# EasyEDA schematic Wildfire_Souce.json
TITLE: Sheet_1; REV: 1.0; Date: 2026-02-07; Sheet: 1/1; Drawn By: Razee; Company: Your Company
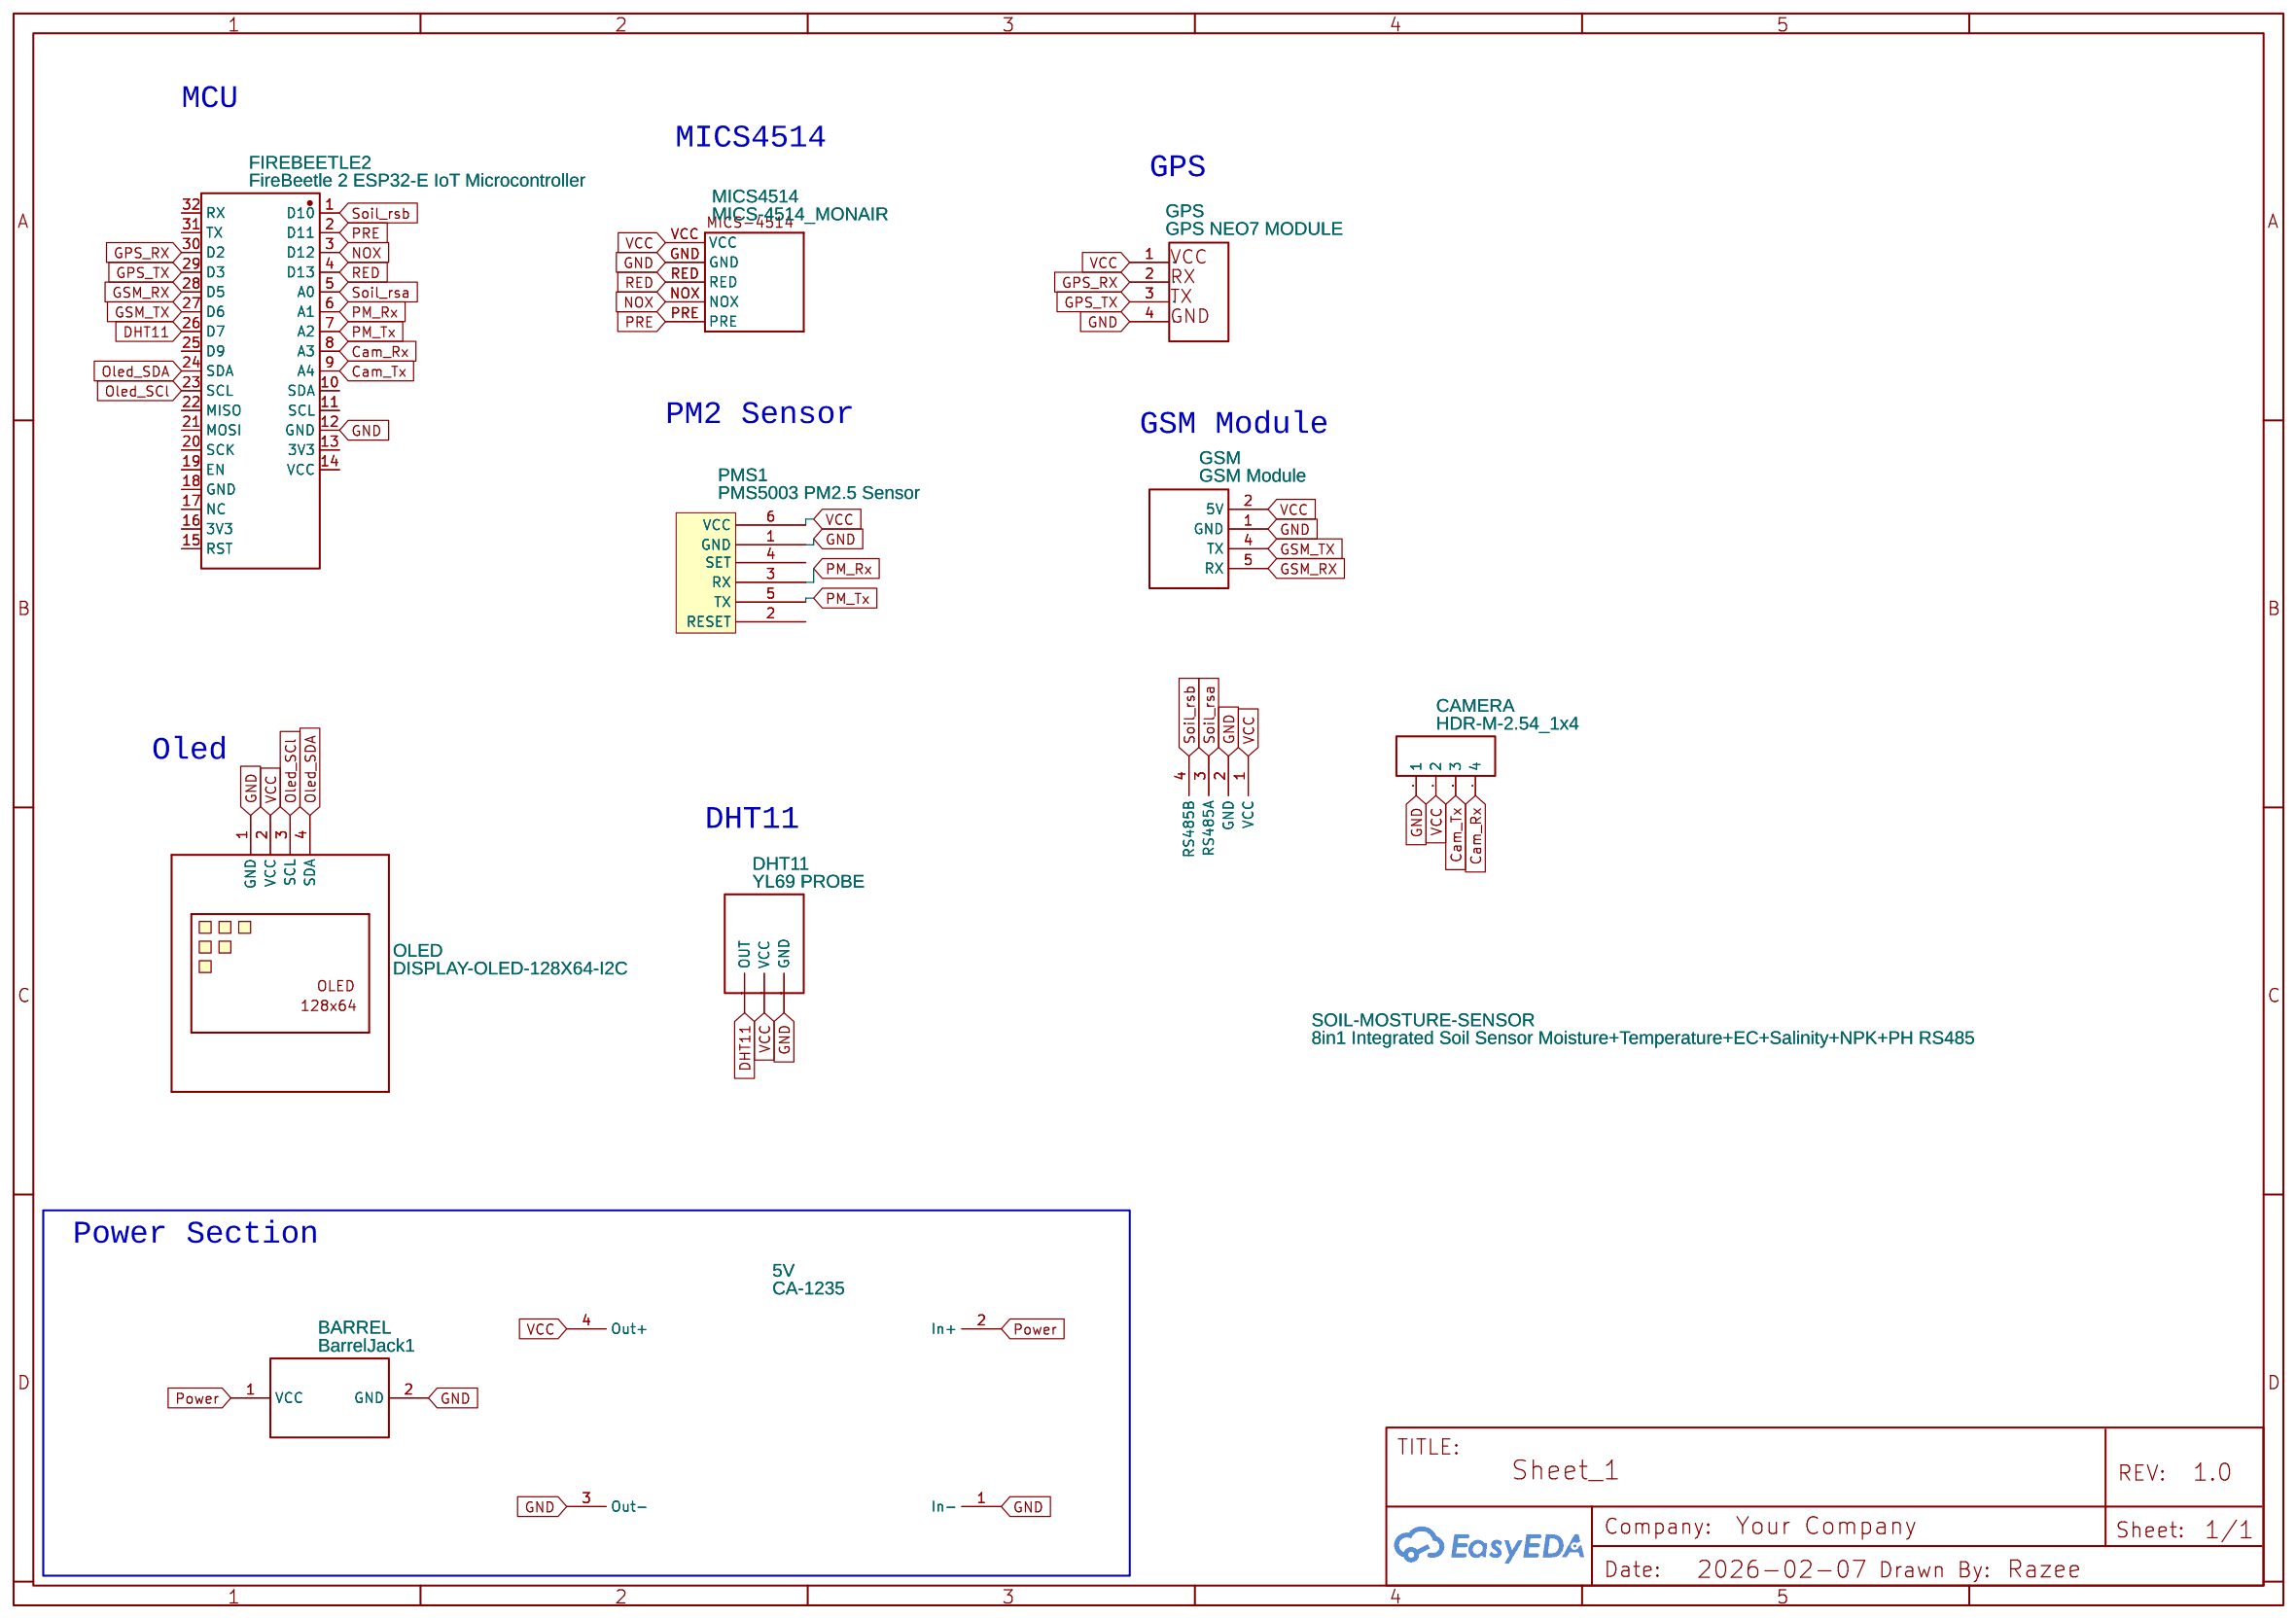
[diagram p0: schematic sheet]

## Parts
5V  CA-1235  [CA-1235]
BARREL  BarrelJack1  [BARRELJACKFC681478]
CAMERA  HDR-M-2.54_1x4  [HDR-M-2.54_1X4]
DHT11  YL69 PROBE  [HUMIDITY AND TEMPERATURE SENSOR]
FIREBEETLE2  FireBeetle 2 ESP32-E IoT Microcontroller  [FIREBEETLE 2 ESP32-E IOT MICROCONTROLLER]
GPS  GPS NEO7 MODULE  [GPS NEO7 MODULE]
GSM  GSM Module  [GSM MODULE]
MICS4514  MICS-4514_MONAIR  [MICS4514]
OLED  DISPLAY-OLED-128X64-I2C  [DISPLAY-OLED-128X64-I2C]
PMS1  PMS5003 PM2.5 Sensor  [PLANTOWER PM2.5 AIR SENSOR]
SOIL-MOSTURE-SENSOR  8in1 Integrated Soil Sensor Moisture+Temperature+EC+Salinity+NPK+PH RS485  [CONNECTOR_PINHEADER_2.54MM:PINHEADER_1X4]

## Library data of the parts
5V = CA-1235: Contributor: Gregory Singleton
BARREL = BarrelJack1: Contributor: SamNewmanTekever
CAMERA = HDR-M-2.54_1x4: Supplier Part: C124378; Supplier: LCSC; Contributor: LCEDA_Lib
DHT11 = YL69 PROBE: Contributor: denislucietto2
FIREBEETLE2 = FireBeetle 2 ESP32-E IoT Microcontroller: Manufacturer: DFRobot; Manufacturer Part: DFR0654-F; Supplier: AliExpress; Supplier Part: DFR0654-F; link: https://www.dfrobot.com/product-2231.html; Contributor: liguorigiuseppe780
GPS = GPS NEO7 MODULE: Contributor: nguyenduythuc.utc2
GSM = GSM Module: Contributor: Phocas Sebastian Sengo
MICS4514 = MICS-4514_MONAIR: Contributor: Ex T
OLED = DISPLAY-OLED-128X64-I2C: Contributor: gtanaka6
PMS1 = PMS5003 PM2.5 Sensor: Contributor: shyriu
SOIL-MOSTURE-SENSOR = JST Connector 4 Pin: Contributor: Sutee.S; Supplier: IVT

## Nets
GND: 5V.1(In-) 5V.3(Out-) BARREL.2(GND) CAMERA.1 DHT11.GND FIREBEETLE2.12(GND) GPS.4 GSM.1(GND) MICS4514.GND OLED.1(GND) PMS1.1(GND) SOIL-MOSTURE-SENSOR.2(GND)
VCC: 5V.4(Out+) CAMERA.2 DHT11.VCC GPS.1 GSM.2(5V) MICS4514.VCC OLED.2(VCC) PMS1.6(VCC) SOIL-MOSTURE-SENSOR.1(VCC)
Cam_Rx: CAMERA.4 FIREBEETLE2.8(A3)
Cam_Tx: CAMERA.3 FIREBEETLE2.9(A4)
DHT11: DHT11.OUT FIREBEETLE2.26(D7)
GPS_RX: FIREBEETLE2.30(D2) GPS.2
GPS_TX: FIREBEETLE2.29(D3) GPS.3
GSM_RX: FIREBEETLE2.28(D5) GSM.5(RX)
GSM_TX: FIREBEETLE2.27(D6) GSM.4(TX)
NOX: FIREBEETLE2.3(D12) MICS4514.NOX
Oled_SCl: FIREBEETLE2.23(SCL) OLED.3(SCL)
Oled_SDA: FIREBEETLE2.24(SDA) OLED.4(SDA)
PM_Rx: FIREBEETLE2.6(A1) PMS1.3(RX)
PM_Tx: FIREBEETLE2.7(A2) PMS1.5(TX)
Power: 5V.2(In+) BARREL.1(VCC)
PRE: FIREBEETLE2.2(D11) MICS4514.PRE
RED: FIREBEETLE2.4(D13) MICS4514.RED
Soil_rsa: FIREBEETLE2.5(A0) SOIL-MOSTURE-SENSOR.3(RS485A)
Soil_rsb: FIREBEETLE2.1(D10) SOIL-MOSTURE-SENSOR.4(RS485B)

Not connected (* = marked no-connect by the designer): FIREBEETLE2 10(SDA) 11(SCL) 13(3V3) 14(VCC) 15(RST) 16(3V3) 17(NC) 18(GND) 19(EN) 20(SCK) 21(MOSI) 22(MISO) 25(D9) 31(TX) 32(RX); PMS1 2(RESET) 4(SET)

## Notes on the sheet
- MCU
- MICS4514
- GPS
- PM2 Sensor
- GSM Module
- Oled
- DHT11
- Power Section
